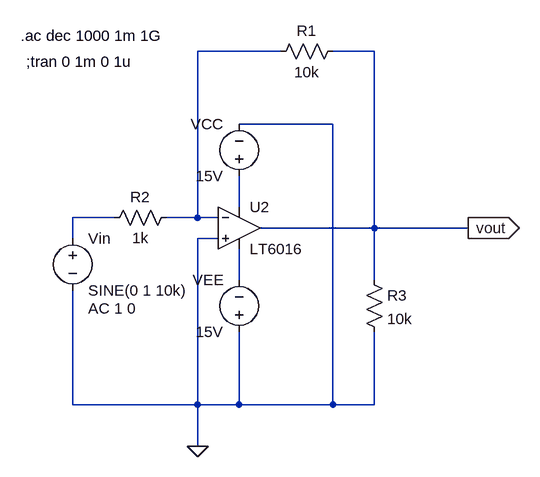
[diagram p0: schematic inverting amp opamp.asc]
inverting amp opamp.asc, the LTspice schematic file:
Version 4
SHEET 1 880 680
WIRE 416 -112 288 -112
WIRE 560 -112 496 -112
WIRE 496 0 352 0
WIRE 352 128 352 80
WIRE 160 144 96 144
WIRE 288 144 288 -112
WIRE 288 144 240 144
WIRE 320 144 288 144
WIRE 560 160 560 -112
WIRE 560 160 384 160
WIRE 704 160 560 160
WIRE 96 176 96 144
WIRE 320 176 288 176
WIRE 352 240 352 192
WIRE 560 240 560 160
WIRE 96 432 96 256
WIRE 288 432 288 176
WIRE 288 432 96 432
WIRE 352 432 352 320
WIRE 352 432 288 432
WIRE 496 432 496 0
WIRE 496 432 352 432
WIRE 560 432 560 320
WIRE 560 432 496 432
WIRE 288 496 288 432
FLAG 288 496 0
FLAG 704 160 vout
IOPIN 704 160 Out
SYMBOL OpAmps\\LT6016 352 160 R0
SYMATTR InstName U2
SYMBOL res 512 -128 R90
WINDOW 0 0 56 VBottom 2
WINDOW 3 32 56 VTop 2
SYMATTR InstName R1
SYMATTR Value 10k
SYMBOL res 256 128 R90
WINDOW 0 0 56 VBottom 2
WINDOW 3 32 56 VTop 2
SYMATTR InstName R2
SYMATTR Value 1k
SYMBOL voltage 96 160 R0
WINDOW 123 24 124 Left 2
WINDOW 39 0 0 Left 0
SYMATTR Value2 AC 1 0
SYMATTR InstName Vin
SYMATTR Value SINE(0 1 10k)
SYMBOL voltage 352 96 R180
WINDOW 0 24 96 Left 2
WINDOW 3 24 16 Left 2
WINDOW 123 0 0 Left 0
WINDOW 39 0 0 Left 0
SYMATTR InstName VCC
SYMATTR Value 15V
SYMBOL voltage 352 336 R180
WINDOW 0 24 96 Left 2
WINDOW 3 24 16 Left 2
WINDOW 123 0 0 Left 0
WINDOW 39 0 0 Left 0
SYMATTR InstName VEE
SYMATTR Value 15V
SYMBOL res 544 224 R0
SYMATTR InstName R3
SYMATTR Value 10k
TEXT 16 -136 Left 2 !.ac dec 1000 1m 1G
TEXT 24 -96 Left 2 !;tran 0 1m 0 1u

The netlist it stands for:
* inverting amp opamp.asc
* U2: LT6016 (symbol OpAmps\LT6016 not available, pins judged from their places): In+=0 In-=N001 V+=N002 V-=N004 OUT=vout
R1 vout N001 10k
R2 N001 N003 1k
Vin N003 0 SINE(0 1 10k) AC 1 0
VCC N002 0 15V
VEE 0 N004 15V
R3 vout 0 10k
.ac dec 1000 1m 1G
;tran 0 1m 0 1u
.backanno
.end